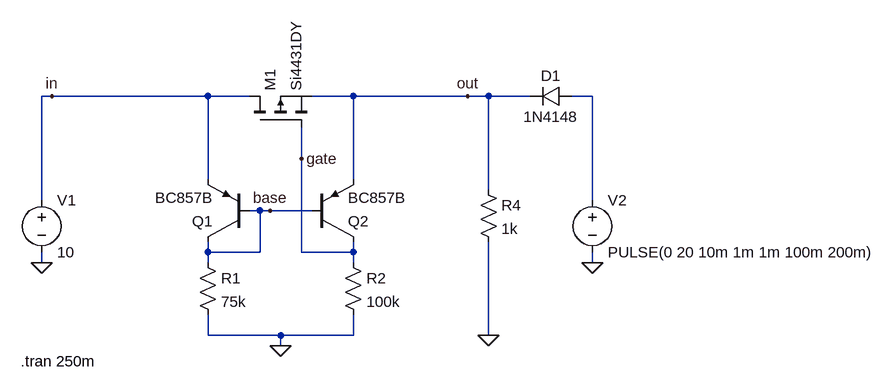
[diagram p0: schematic Ideal_Diode.asc]
Ideal_Diode.asc, the LTspice schematic file:
Version 4
SHEET 1 1268 680
WIRE -48 0 -64 0
WIRE 192 0 -48 0
WIRE 256 0 192 0
WIRE 416 0 352 0
WIRE 592 0 416 0
WIRE 624 0 592 0
WIRE 688 0 624 0
WIRE 784 0 752 0
WIRE 336 96 336 48
WIRE 192 128 192 0
WIRE 416 128 416 0
WIRE 624 144 624 0
WIRE -64 160 -64 0
WIRE 784 160 784 0
WIRE 272 176 256 176
WIRE 288 176 272 176
WIRE 352 176 288 176
WIRE 192 240 192 224
WIRE 272 240 272 176
WIRE 272 240 192 240
WIRE 336 240 336 96
WIRE 416 240 416 224
WIRE 416 240 336 240
WIRE -64 256 -64 240
WIRE 192 256 192 240
WIRE 416 256 416 240
WIRE 784 256 784 240
WIRE 192 368 192 336
WIRE 304 368 192 368
WIRE 416 368 416 336
WIRE 416 368 304 368
WIRE 624 368 624 224
WIRE 304 384 304 368
FLAG -64 256 0
FLAG 304 384 0
FLAG -48 0 in
FLAG 288 176 base
FLAG 624 368 0
FLAG 592 0 out
FLAG 784 256 0
FLAG 336 96 gate
SYMBOL pnp 256 224 R180
SYMATTR InstName Q1
SYMATTR Value BC857B
SYMBOL pnp 352 224 M180
SYMATTR InstName Q2
SYMATTR Value BC857B
SYMBOL res 176 240 R0
SYMATTR InstName R1
SYMATTR Value 75k
SYMBOL res 400 240 R0
SYMATTR InstName R2
SYMATTR Value 100k
SYMBOL voltage -64 144 R0
WINDOW 123 0 0 Left 0
WINDOW 39 0 0 Left 0
SYMATTR InstName V1
SYMATTR Value 10
SYMBOL res 608 128 R0
SYMATTR InstName R4
SYMATTR Value 1k
SYMBOL voltage 784 144 R0
WINDOW 123 0 0 Left 0
WINDOW 39 0 0 Left 0
SYMATTR InstName V2
SYMATTR Value PULSE(0 20 10m 1m 1m 100m 200m)
SYMBOL pmos 256 48 R270
SYMATTR InstName M1
SYMATTR Value Si4431DY
SYMBOL diode 752 -16 R90
WINDOW 0 0 32 VBottom 2
WINDOW 3 32 32 VTop 2
SYMATTR InstName D1
SYMATTR Value 1N4148
TEXT -96 408 Left 2 !.tran 250m

The netlist it stands for:
* Ideal_Diode.asc
Q1 base base in 0 BC857B
Q2 gate base out 0 BC857B
R1 base 0 75k
R2 gate 0 100k
V1 in 0 10
R4 out 0 1k
V2 N001 0 PULSE(0 20 10m 1m 1m 100m 200m)
M1 in gate out out Si4431DY
D1 N001 out 1N4148
.model D D
.lib standard.dio
.model NPN NPN
.model PNP PNP
.lib standard.bjt
.model NMOS NMOS
.model PMOS PMOS
.lib standard.mos
.tran 250m
.backanno
.end